# Altium project IR-Sensor.PrjPcb
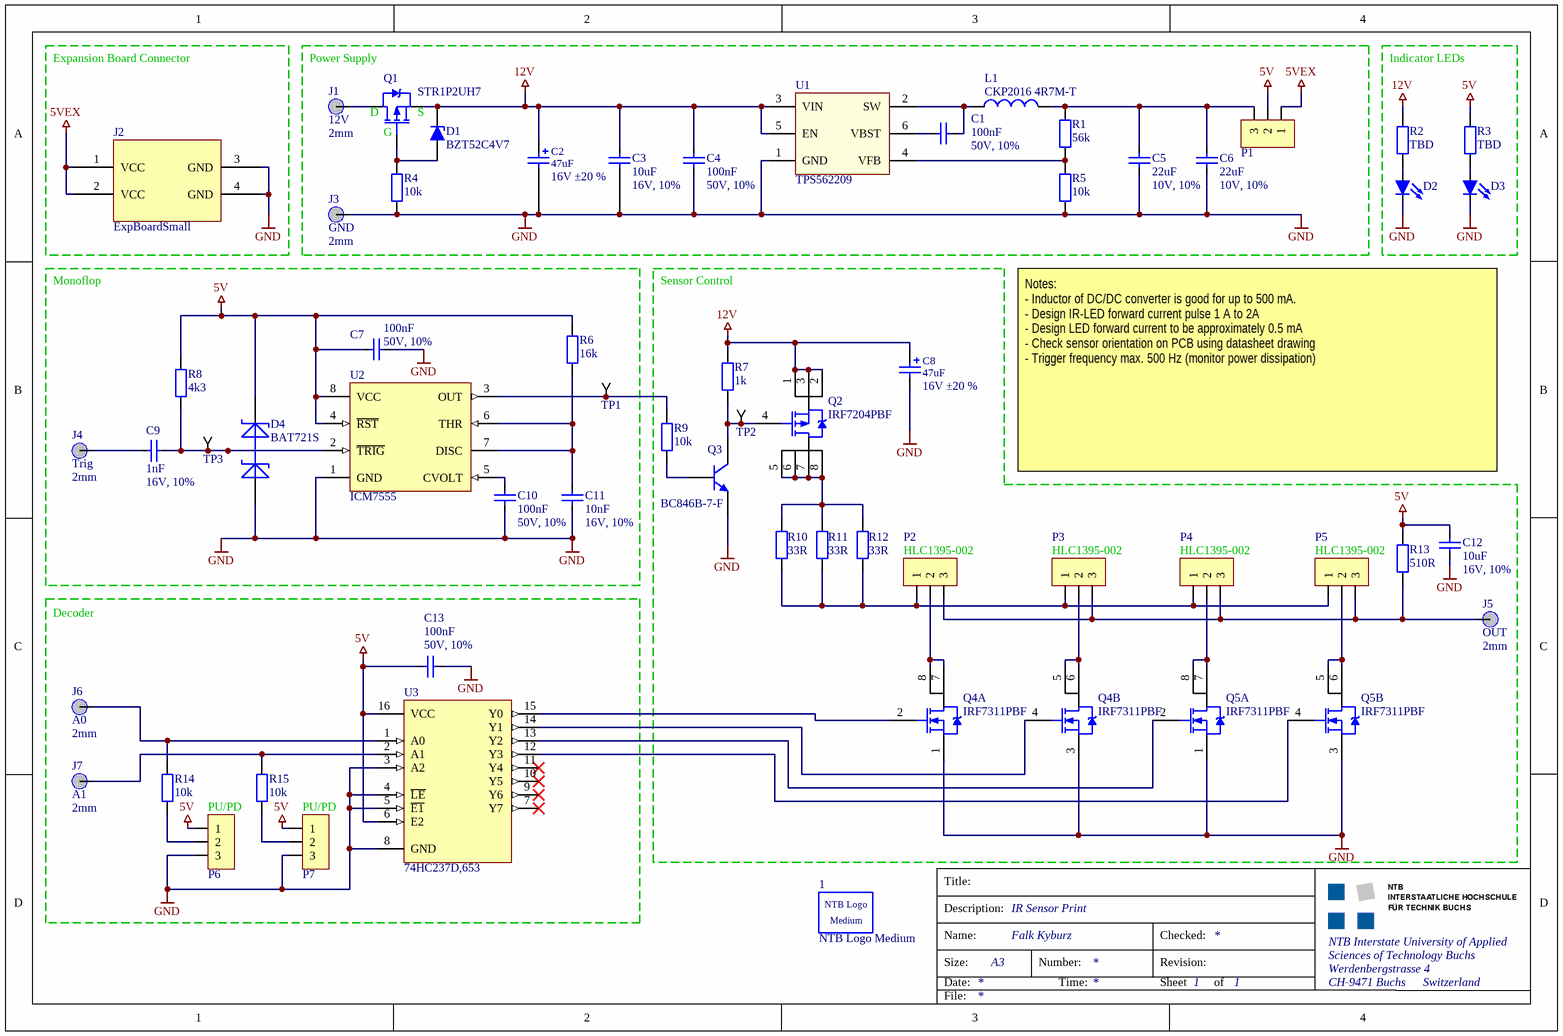
[diagram p0: IR-Sensor.SchDoc]
GlobalTitle: Systemtechnikprojekt Spezialistenausbildung IR Sensor; RevisionDate: 01.01.2016
1 sheet, 59 parts. Net scope: global (net labels, ports and power ports of the same name join across sheets).
Board file: IR-Sensor.PcbDoc

## Sheet IR-Sensor.SchDoc: =GlobalTitle
size A4; Author: Falk Kyburz; CompanyName: NTB; Organization: NTB Interstate University of Applied; Address1: Werdenbergstrasse 4; Address3: CH-9471 Buchs; Address4: Switzerland; SheetNumber: 1; SheetTotal: 1; Organization1: Sciences of Technology Buchs; Size: A3; ShortDescription: IR Sensor Print

### Parts
1  NTB Logo Medium  [NTB Logo Medium]
C1  100nF  ValAddon: 50V, 10%  [CAP-0805[2012]]
C2  value 47uF  ValueAddon: 16V ±20 %  [CDE_CAP AVE CODE D_H]  (hidden comment: AVE476M16D16T-F)
C3  10uF  ValAddon: 16V, 10%  [CAP-1206[3216]]
C4  100nF  ValAddon: 50V, 10%  [CAP-0805[2012]]
C5  22uF  ValAddon: 10V, 10%  [CAP-1206[3216]]
C6  22uF  ValAddon: 10V, 10%  [CAP-1206[3216]]
C7  100nF  ValAddon: 50V, 10%  [CAP-0805[2012]]
C8  value 47uF  ValueAddon: 16V ±20 %  [CDE_CAP AVE CODE D_H]  (hidden comment: AVE476M16D16T-F)
C9  1nF  ValueAddon: 16V, 10%  [CAP-0805[2012]]
C10  100nF  ValAddon: 50V, 10%  [CAP-0805[2012]]
C11  10nF  ValueAddon: 16V, 10%  [CAP-0805[2012]]
C12  10uF  ValAddon: 16V, 10%  [CAP-1206[3216]]
C13  100nF  ValAddon: 50V, 10%  [CAP-0805[2012]]
D1  BZT52C4V7  [SOD-123]
D2  LTST-C190GKT  [LED 0603 green]  (value not drawn)
D3  LTST-C190GKT  [LED 0603 green]  (value not drawn)
D4  BAT721S  [SOT-23]
J1  12V  Size: 2mm  [Laborbuchse 2mm]
J2  ExpBoardSmall  [EXPBOARDCON]
J3  GND  Size: 2mm  [Laborbuchse 2mm]
J4  Trig  Size: 2mm  [Laborbuchse 2mm]
J5  OUT  Size: 2mm  [Laborbuchse 2mm]
J6  A0  Size: 2mm  [Laborbuchse 2mm]
J7  A1  Size: 2mm  [Laborbuchse 2mm]
L1  CKP2016 4R7M-T  [IND-0806]
P1  3 Pin Header  [3PIN HEADER 2.54MM]  (value not drawn)
P2  3 Pin Header Buchse  [3PIN HEADER SOCKET 2.54MM]  (value not drawn)
P3  3 Pin Header Buchse  [3PIN HEADER SOCKET 2.54MM]  (value not drawn)
P4  3 Pin Header Buchse  [3PIN HEADER SOCKET 2.54MM]  (value not drawn)
P5  3 Pin Header Buchse  [3PIN HEADER SOCKET 2.54MM]  (value not drawn)
P6  3 Pin Header  [3PIN HEADER 2.54MM]  (value not drawn)
P7  3 Pin Header  [3PIN HEADER 2.54MM]  (value not drawn)
Q1  STR1P2UH7  [SOT-23]
Q2  IRF7204PBF  [SOIC-8]
Q3  BC846B-7-F  [SOT-23]
Q4  IRF7311PBF  [SOIC-8]  (parts A,B of 2)
Q5  IRF7311PBF  [SOIC-8]  (parts A,B of 2)
R1  56k  [RES-0805[2012]]
R2  TBD  [RES-0805[2012]]
R3  TBD  [RES-0805[2012]]
R4  10k  [RES-0805[2012]]
R5  10k  [RES-0805[2012]]
R6  16k  [RES-0805[2012]]
R7  1k  [RES-0805[2012]]
R8  4k3  [RES-0805[2012]]
R9  10k  [RES-0805[2012]]
R10  value 33R  [RES-0805[2012]]  (hidden comment: 10R 1% 0805(2012))
R11  value 33R  [RES-0805[2012]]  (hidden comment: 10R 1% 0805(2012))
R12  value 33R  [RES-0805[2012]]  (hidden comment: 10R 1% 0805(2012))
R13  510R  [RES-0805[2012]]
R14  10k  [RES-0805[2012]]
R15  10k  [RES-0805[2012]]
TP1  Testpoint SMD 1206  [TP-SMD-1206]  (value not drawn)  (no BOM)
TP2  Testpoint SMD 1206  [TP-SMD-1206]  (value not drawn)  (no BOM)
TP3  Testpoint SMD 1206  [TP-SMD-1206]  (value not drawn)  (no BOM)
U1  TPS562209  [SOT-23-6]
U2  ICM7555  [SOIC-8]
U3  74HC237D,653  [SOIC-16]

### Blocks framed on the sheet
Expansion Board Connector: J2
Indicator LEDs: D2 D3 R2 R3
Monoflop: C7 C9-C11 D4 J4 R6 R8 TP1 TP3 U2

### Nets
5V: C7.1(Pos) C12.1(Pos) C13.1(Pos) D4.2(cathode2) P1.2 P6.1 P7.1 R3.2 R6.2 R8.2 R13.2 U2.4(~{RST}) U2.8(VCC) U3.6(E2) U3.16(VCC)
5VEX: J2.1(VCC) J2.2(VCC) P1.1
12V: C2.1(Pos) C3.1(Pos) C4.1(Pos) C8.1(Pos) D1.1(K) Q1.2(S) Q2.1(S) Q2.2(S) Q2.3(S) R2.2 R7.2 U1.3(VIN) U1.5(EN)
GND: C2.2(Neg) C3.2(Neg) C4.2(Neg) C5.2(Neg) C6.2(Neg) C7.2(Neg) C8.2(Neg) C10.2(Neg) C11.2(Neg) C12.2(Neg) C13.2(Neg) D2.1(K) D3.1(K) D4.1(Anode1) J2.3(GND) J2.4(GND) J3.1 P6.3 P7.3 Q3.2(E) Q4.1(S) Q4.3(S) Q5.1(S) Q5.3(S) R4.1 R5.1 U1.1(GND) U2.1(GND) U3.3(A2) U3.4(~{LE}) U3.5(~{E1}) U3.8(GND)
NetC1_1: C1.1(Pos) U1.6(VBST)
NetC1_2: C1.2(Neg) L1.1 U1.2(SW)
NetC5_1: C5.1(Pos) C6.1(Pos) L1.2 P1.3 R1.2
NetC9_1: C9.1(Pos) J4.1
NetC9_2: C9.2(Neg) D4.3(Cathode1,_anode2) R8.1 TP3.1 U2.2(~{TRIG})
NetC10_1: C10.1(Pos) U2.5(CVOLT)
NetC11_1: C11.1(Pos) R6.1 U2.6(THR) U2.7(DISC)
NetD1_2: D1.2(A) Q1.1(G) R4.2
NetD2_2: D2.2(A) R2.1
NetD3_2: D3.2(A) R3.1
NetJ1_1: J1.1 Q1.3(D)
NetJ5_1: J5.1 P2.3 P3.3 P4.3 P5.3 R13.1
NetJ6_1: J6.1 R14.2 U3.1(A0)
NetJ7_1: J7.1 R15.2 U3.2(A1)
NetP2_1: P2.1 P3.1 P4.1 P5.1 R10.2 R11.2 R12.2
NetP2_2: P2.2 Q4.7(D) Q4.8(D)
NetP3_2: P3.2 Q4.5(D) Q4.6(D)
NetP4_2: P4.2 Q5.7(D) Q5.8(D)
NetP5_2: P5.2 Q5.5(D) Q5.6(D)
NetP6_2: P6.2 R14.1
NetP7_2: P7.2 R15.1
NetQ2_4: Q2.4(G) Q3.3(C) R7.1 TP2.1
NetQ2_5: Q2.5(D) Q2.6(D) Q2.7(D) Q2.8(D) R10.1 R11.1 R12.1
NetQ3_1: Q3.1(B) R9.2
NetQ4_2: Q4.2(G) U3.15(Y0)
NetQ4_4: Q4.4(G) U3.14(Y1)
NetQ5_2: Q5.2(G) U3.13(Y2)
NetQ5_4: Q5.4(G) U3.12(Y3)
NetR1_1: R1.1 R5.2 U1.4(VFB)
NetR9_1: R9.1 TP1.1 U2.3(OUT)

Not connected (* = marked no-connect by the designer): U3 7(Y7)* 9(Y6)* 10(Y5)* 11(Y4)*

### Notes on the sheet
- Power Supply
- (near Q1) D
- (near Q1) S
- (near Q1) G
- Sensor Control
- Notes:
  - Inductor of DC/DC converter is good for up to 500 mA.
  - Design IR-LED forward current pulse 1 A to 2A
  - Design LED forward current to be approximately 0.5 mA
  - Check sensor orientation on PCB using datasheet drawing
  - Trigger frequency max. 500 Hz (monitor power dissipation)
- HLC1395-002
- (near P3) HLC1395-002
- (near P4) HLC1395-002
- Decoder
- PU/PD
- (near P7) PU/PD
- Title:
- Description:
- Size:
- Date:
- Name:
- Number:
- Time:
- Revision:
- Sheet
- Checked:
- of
- File:
- (in symbol NTB Logo Medium) NTB Logo; Medium

### Library data of the parts
C1 C4 C7 C10 C13 = MLCC 0805 100n 50V: 100n 50V X7R MLCC 0805 (1608 Metric); Tolerance: 10%; Case-EIA: 0803; Case-Metric: 2013; Rated Voltage: 50V; Temperature Characteristics EIA: X7R; Temperature Range EIA: -55C/+125C; Value: 100nF
  C4: ClassName: Connect_Full1
C2 C8 = ELKO 47uF 16V: ELKO, 47uF, 16V, CDE_AVE476M16D16T-F_AVE CODE D; Manufacturer: Cornell Dubilier; #Class: PASSIVE; #ClassSub: CAPACITOR; RefFootprint: CDE_CAP AVE CODE D; Distributor PartNr: 598-AVE476M16D16T-F; Distributor: Mouser; Published: 20121220; Publisher: Stefan Ursella, M.Eng; ComponentLink1Description: Manufacturer Link; ComponentLink2Description: Datasheet; ComponentLink2URL: http://www.cde.com/catalogs/AVE.pdf; ComponentLink3Description: Packaging Specification; Manufacturer PartNr: AVE476M16D16T-F; RefFileFOO: *; RefFileSCH: *; RefSchema: CDE_AVE476M16D16T-F_AVE CODE D; ClassName: Connect_Full
C3 C12 = MLCC 1206 10u 16V: 10u 16V X7R MLCC 1206 (3016 Metric); Rated Voltage: 10V; Tolerance: 10%; Case-EIA: 1206; Case-Metric: 3216; Temperature Characteristics EIA: X7R; Temperature Range EIA: -55C/+125C; Value: 10uF
  C3: ClassName: Connect_Full1
C5 C6 = MLCC 1206 22u 10V: 22u 10V X7R MLCC 1206 (3016 Metric); Tolerance: 10%; Case-EIA: 1206; Case-Metric: 3216; Rated Voltage: 10V; Temperature Characteristics EIA: X7R; Temperature Range EIA: -55C/+125C; Value: 22uF; ClassName: Connect_Full
C9 = MLCC 0805 1n 16V: MLCC - SMD/SMT 0805 1000pF 16V C0G 10%; Manufacturer: Vishay; Manufacturer PartNr: VJ0805A102KXJPW1BC; RefFootprint: Gen_0805_H; RefSchema: Cap_1nF; #Class: *; #SubClass: *; Published: 18.12.14; Publisher: SCLM; RefFileFOO: *; RefFileSCH: *; ComponentLink1Description: Manufacturer Link; ComponentLink1URL: http://www.vishay.com/product?docid=28548; ComponentLink2Description: Datasheet; ComponentLink2URL: http://www.vishay.com/docs/28548/vjw1bcbascomseries.pdf; Supplier 1: Mouser; Supplier Part Number 1: 77-VJ0805A102KXJPBC; Status: Lager?; Value: 1nF
C11 = MLCC 0805 10n 16V: 10n 16V X7R MLCC 0805; Manufacturer: AVX; Manufacturer PartNr: 0805YC103KAT2A; #Class: *; #SubClass: *; Published: 09.01.15; Publisher: SCLM; RefFootprint: *; RefFileFOO: *; RefFileSCH: *; RefSchema: *; ComponentLink1Description: Manufacturer Link; ComponentLink1URL: http://www.avx.com/prodinfo_productdetail.asp?I=45&K=search&C=&word=0805YC103KAT2A&form=number&Number=; ComponentLink2Description: Datasheet; ComponentLink2URL: http://www.farnell.com/datasheets/1679506.pdf; Status: LAger?; Value: 10nF
D1 = BZT52C4V7: 4.7V Zener-Diode, BZT52C4V7; Forward Current: 1.5 A; Forward Voltage: 1.25V; Reverse Voltage: 600V; ComponentLink1Description: Datasheet RF2L6S; ComponentLink1URL: V:\Diodes\RHOM_RF2L6S.pdf
D2 D3 = LED Green: LED SMD 0603 green 6mcd; Forward Current: 30mA; Forward Voltage: 2.1V; Spectrum: 565nm; Color: green; ComponentLink1Description: Datasheet LTST-C190GKT; ComponentLink1URL: V:\Diodes\Lite-On-LTST-C190GKT.pdf
D4 = BAT721S-SOT23: NXP  BAT721S  SCHOTTKY-DIODE, 2FACH; RefFootprint: CDE_CAP AVE CODE D; RefSchema: CDE_AVE476M16D16T-F_AVE CODE D; ComponentLink1Description: Manufacturer Link; ComponentLink1URL: http://www.nxp.com/search?q=%09bat721s&type=keyword&rows=10; ComponentLink2Description: Datasheet; ComponentLink2URL: http://www.farnell.com/datasheets/453891.pdf; ComponentLink3Description: Packaging Specification; Distributor: Farnell; Distributor PartNr: 1081200; Manufacturer: NXP; Manufacturer PartNr: BAT721S; Published: 20150612; Publisher: SCNP
J1 J3-J7 = Laborbuchse: #Class: Connector; Publisher: B.Sc. Ursella; #ClassSub: Laborbuchse; Published: 2008-12-16; Status: nLager; RefFootprint: Laborbuchse 2mm; RefFileFOO: *; RefFileSCH: *; RefSchema: Laborbuchse
J2 = ExpBoardSmall: Rule: UNIONINDEX{}0[]RULEKIND{}ComponentClearance[]NETSCOPE{}AnyNet[]LAYERKIND{}SameLayer[]NAME{}Schematic Component Clearance Constraint[]GAP{}0mil[]COLLISIONCHECKMODE{}3[]VERTICALGAP{}0mil[]SHOWDISTANCES{}FALSE[]UNIT{}Metric[]PcbType{}ProtelPcb
L1 = L 4.7u: MULTILAYER CHIP POWER INDUCTORS; Manufactor: Taiyo Yuden; Current Rating: 900mA; DCR: 160mOhm; Inductance: 4u7; ComponentLink1Description: Datasheet Taiyo Yuden CK Series; ComponentLink1URL: V:\Inductor\Taiyo_Yuden_CK_Series.pdf; ClassName: Connect_Full
P1 P6 P7 = 3 Pin Header: 3 Pin Header 2.54mm; RefFootprint: GEN_Buchsenleiste-2.54MM_3; RefSchema: Gen_Buchsenleiste_3-Pin; #Class: *; #SubClass: *; Manufacturer: *; Manufacturer PartNr: *; Published: 16.12.2014; Publisher: SCLM; RefFileFOO: *; RefFileSCH: *; ComponentLink1Description: Manufacturer Link; ComponentLink1URL: *; ComponentLink2Description: Datasheet; ComponentLink2URL: *; Status: Lager?
P2-P5 = 3 Pin Header Buchse: 3 Pin Header 2.54mm Buchse; #Class: *; #SubClass: *; Manufacturer: *; Manufacturer PartNr: *; ComponentLink1Description: Manufacturer Link; ComponentLink1URL: *; ComponentLink2Description: *; ComponentLink2URL: *
Q1 = STR1P2UH7: Low Power P-Kanal Mosfet; Manufacturer: ST Microelectronics; Rdson: 100mOhm; Vde: 30; ComponentLink1Description: Manufacturer Link; ComponentLink2Description: Datasheet; ClassName: Connect_Full
Q2 = IRF7204: High Power P-Kanal Mosfet; Manufacturer: International Rectifiers; RefFootprint: IRF_SO8_H; RefSchema: IRF_IRF7204_SO-8; Published: 8-Jun-2000; Publisher: Altium Limited; ComponentLink1Description: Manufacturer Link; ComponentLink1URL: http://www.irf.com/; ComponentLink2Description: Datasheet; ComponentLink2URL: http://www.irf.com/product-info/datasheets/data/irf7204.pdf; Manufacturer PartNr: IRF7204PBF; Supplier Part Number 1: 9103350; Supplier 1: Farnell; RefFileFOO: *; RefFileSCH: *; Status: nLager; #Class: *; #SubClass: *
Q3 = BC846B-SOT23: NPN General-purpose Transistor; Manufacturer: DIODES INC; #Class: SEMICONDUCTOR-TRANSISTOR; #ClassSub: BJT-NPN; RefFootprint: DIODS_SOT23_1B2E3C_3_H; RefSchema: DIODS_BC846B-7-F_SOT23; Published: 17-Sep-2003; Publisher: Altium Limited; ComponentLink1Description: Manufacturer Link; ComponentLink1URL: http://www.diodes.com/products/catalog/detail.php?item-id=6689&popup=datasheet; ComponentLink2Description: Datasheet; ComponentLink2URL: http://www.diodes.com/datasheets/ds11108.pdf; ComponentLink3Description: Packaging Specification; ComponentLink3URL: http://www.diodes.com/datasheets/ap02001.pdf; Distributor: Farnell; Manufacturer PartNr: BC846B-7-F; Distributor PartNr: 1773617; Status: nLager; RefFileFOO: *; RefFileSCH: *
Q4 Q5 = IRF7311: Dual N-Kanal Mosfet; Manufacturer: International Rectifier; RefFootprint: IRF_SO8_H; RefSchema: IRF_IRF7311_SO-8; Published: 8-Jun-2000; Publisher: Altium Limited; ComponentLink1Description: Manufacturer Link; ComponentLink1URL: http://www.irf.com/; ComponentLink2Description: Datasheet; ComponentLink2URL: http://www.irf.com/product-info/datasheets/data/irf7311.pdf; Supplier 1: Farnell; Manufacturer PartNr: IRF7311PBF; Supplier Part Number 1: 1013364; RefFileFOO: *; RefFileSCH: *; #Class: *; #SubClass: *; Status: nLager
R1-R9 R13-R15 = RES 0805: 0805 (2013 Metric) 1/10 W 10K 1 Thick Film Chip Resistor; Power: 1/10 W; Case-EIA: 0805; Case-Metric: 2013; Tolerance: 1%; Temp. Coefficent: ±100ppm; Technology: SMT
  R1: Value: 56k
  R2 R3: Value: TBD
  R4 R5 R9 R14 R15: Value: 10k
  R6: Value: 16k
  R7: Value: 1k
  R8: Value: 4k3
  R13: Value: 510R
R10-R12 = PassResBas0805-00750-A.1: 1R8 0.125W 1% 0805 (2012 Metric)  SMD; ValueAddON: 1% 0.125W; #SubClass: Resistor SMD; RefSchema: R; RefFileSCH: Symbols-generic; RefFileFOO: SMD-Chip-generic; #Class: Passiv-Components; ComponentLink1Description: Manufacturer Link; ComponentLink3Description: Packaging Specification; ComponentLink2Description: Datasheet; Status: nLager; Supplier 1: Farnell; Supplier Part Number 1: 2141642
TP1-TP3 = Testpoint SMD 1206: Testpoint xSmall; Type: Standard (No BOM)
U1 = TPS562209-SOT23-6: 3-A Synchronous Step-Down Voltage Regulator; Manufactor: Texas Instruments; Order Nr.: TPS562209DDCR; ComponentLink1Description: Datasheet TPS56x209; ComponentLink1URL: V:\Power_Management_ICs\PWM_Cont\TPS56x209.pdf; ClassName: Connect_Full
U2 = ICM7555-SOIC8: General purpose CMOS timer; Manufacturer: National Semiconductor; #Class: Analog; #SubClass: Timer Circuit; RefFootprint: NXP_SO8(SOT96-1)_H; RefSchema: NXP_ICM7555_SO-8; Published: 15/04/2002; Publisher: Altium Hobart Technology Centre; ComponentLink1Description: Datasheet; ComponentLink2Description: Distributor; ComponentLink1URL: http://www.datasheetcatalog.org/datasheet/intersil/fn2867.pdf; ComponentLink2URL: https://www.distrelec.ch/ishopWebFront/catalog/product.do/para/node/is/acaaabaaacaf/and/highlightNode/is/640145/and/id/is/01/and/series/is/1.html; Supplier 1: Mouser Electronics; Manufacturer PartNr: ICM7555; Supplier Part Number 1: 771-ICM7555; RefFileFOO: *; RefFileSCH: *; Status: nLager
U3 = 74HC237D-SOIC16: 3-to-8 line decoder, demultiplexer, NXP, SO16; RefFootprint: NXP_SO16(SOT109-1)_H; RefSchema: NXP_74HC237D_SO-16; Supplier 1: Mouser Electronics; Supplier Part Number 1: 771-HC237D653; Manufacturer PartNr: 74HC237D,653; Status: nLager; #Class: *; #SubClass: *; Manufacturer: NXP; Published: 28.11.2014; Publisher: SCLM; RefFileFOO: *; RefFileSCH: *; ComponentLink1Description: Manufacturer Link; ComponentLink1URL: http://www.nxp.com/products/logic/decoders_demultiplexers/74HC237D.html; ComponentLink2Description: Datasheet; ComponentLink2URL: http://www.nxp.com/documents/data_sheet/74HC237.pdf